# Altium project ePBR25_ACU_Power.PrjPCB (part 1 of 2)
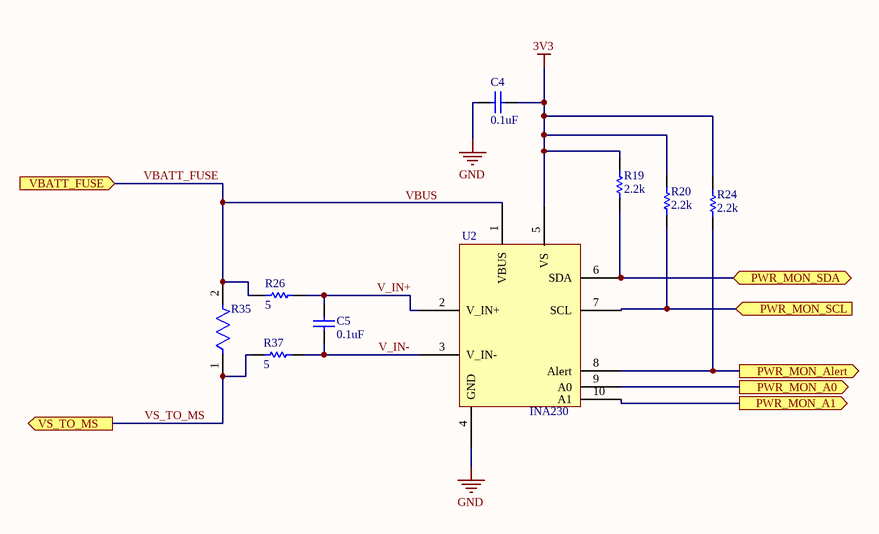
[diagram p0: 2  - Power Switch.SchDoc]
8 sheets, 154 parts. Net scope: hierarchical (ports join the sheet entries above them; power ports are global).
Board files: ePBR24_ACU_Power_rev0.PcbDoc, ePBR20_ACU_Power_rev0.PcbDoc, ePBR24_ACU_Power_rev0.PcbDoc, ePBR25_ACU_Power_rev0.PcbDoc, ePBR20_ACU_Power_rev0.PcbDoc
Sheets:
  2  - Power Switch.SchDoc
  1  - Connectors.SchDoc
    Designator = 2  - Battery Sensing and Control.SchDoc
    Designator = 3  - Fuses.SchDoc
    Designator = 6  - Load Drivers.SchDoc
    Designator = 8  - Voltage Conversions Delays.SchDoc
    Designator = 9  - UV OV Protection.SchDoc
    Designator = 10  - Latching Delay.SchDoc

## Sheet 2  - Power Switch.SchDoc
size A4

### Parts
(Parts that share a designator on the sheet are numbered #1, #2 ... from top to bottom, then left to right.)
C4#1  value 0.1uF  [0603R-generic]  (hidden comment: Cap)
C5#1  value 0.1uF  [0603R-generic]  (hidden comment: Cap)
R19#1  2.2k  [RESC0603(1608)_L]
R20#1  2.2k  [RESC0603(1608)_L]
R24#1  2.2k  [RESC0603(1608)_L]
R26#1  5  [RESC0603(1608)_L]
R35#1  WSLF25122L000FEA  [FP-WSLF25122L000FEA-MFG]  (value not drawn)
R37#1  5  [RESC0603(1608)_L]
U2#1  INA230  [SOP50P490X110-10N]

### Ports
PWR_MON_A0 (out), PWR_MON_A1 (out), PWR_MON_Alert (out), PWR_MON_SCL (in), PWR_MON_SDA (bidir), VBATT_FUSE (in), VS_TO_MS (out)

### Nets
3V3: C4#1.1 R19#1.2 R20#1.2 R24#1.2 U2#1.5(VS)
GND: C4#1.2 U2#1.4(GND)
PWR_MON_A0: U2#1.9(A0) ; port PWR_MON_A0
PWR_MON_A1: U2#1.10(A1) ; port PWR_MON_A1
PWR_MON_Alert: R24#1.1 U2#1.8(Alert) ; port PWR_MON_Alert
PWR_MON_SCL: R20#1.1 U2#1.7(SCL) ; port PWR_MON_SCL
PWR_MON_SDA: R19#1.1 U2#1.6(SDA) ; port PWR_MON_SDA
V_IN+: C5#1.2 R26#1.1 U2#1.2(V_IN+)
V_IN-: C5#1.1 R37#1.1 U2#1.3(V_IN-)
VBATT_FUSE: R26#1.2 R35#1.2 U2#1.1(VBUS) ; port VBATT_FUSE
VS_TO_MS: R35#1.1 R37#1.2 ; port VS_TO_MS

### Notes on the sheet
- Labels drawn without touching a wire or pin: VBUS

### Library data of the parts
C4#1 C5#1 = Cap: Capacitor; Manufacturer: Yageo; Manufacturer Part Number: CC1210ZKY5V8BB106; Capacitance: 10µF; Tolerance: -20%, +80%; Voltage - Rated: 25V; Temperature Coefficient: Y5V (F); Supplier 1: Digi-Key; Supplier Part Number 1: 311-2063-1-ND; RoHS: RoHS Compliant; Category: Capacitors; Stock 1: 1156; Pricing 1: 1=0.47, 10=0.323, 25=0.258, 50=0.2154, 100=0.1829, 250=0.14528, 500=0.12912, 1000=0.11298 (CAD); Packaging: Cut Tape (CT); Part Status: Active; Operating Temperature: -30°C ~ 85°C; Features: -; Ratings: -; Applications: General Purpose; Failure Rate: -; Mounting Type: Surface Mount, MLCC; Package / Case: 1210 (3225 Metric); Size / Dimension: 0.126" L x 0.098" W (3.20mm x 2.50mm); Height - Seated (Max): -; Thickness (Max): 0.083" (2.10mm); Lead Spacing: -; Lead Style: -; ComponentLink1URL: http://www.yageo.com/documents/recent/UPY-GPHC_Y5V_6.3V-to-50V_7.pdf; ComponentLink1Description: http://www.yageo.com/documents/recent/UPY-GPHC_Y5V_6.3V-to-50V_7.pdf; Supplier 2: Digi-Key; Supplier Part Number 2: 1276-1869-1-ND
R19#1 R20#1 R24#1 R26#1 R37#1 = CMP-1591-00001-1: 0603 (1608 Metric) Chip Resistor; Case-Metric: 1608; Case-EIA: 0603; PackageReference: RESC0603(1608); Supplier 1: Digi-Key; Supplier Part Number 1: P430BZCT-ND
R35#1 = CMP-02407-012168-1: RES 0.002 OHM 1% 5W 2512; Resistance: 2mR; Temperature Coefficient: 70ppm/°C; RoHS Compliant: Yes; Case/Package: 2512; Length: 0.25inch; Height: 0.024inch; Max Power Dissipation: 5W; Lead Free: Lead Free; Features: Moisture Resistant; Min Operating Temperature: -65°C; Max Operating Temperature: 170°C; Case Code (Metric): 6432; Tolerance: 1%; Width: 0.125inch; Case Code (Imperial): 2512; Packaging: Tape and Reel; Resistor Type: Metal Element; Number of Terminations: 2

## Sheet 1  - Connectors.SchDoc
size 471 x 281 mm
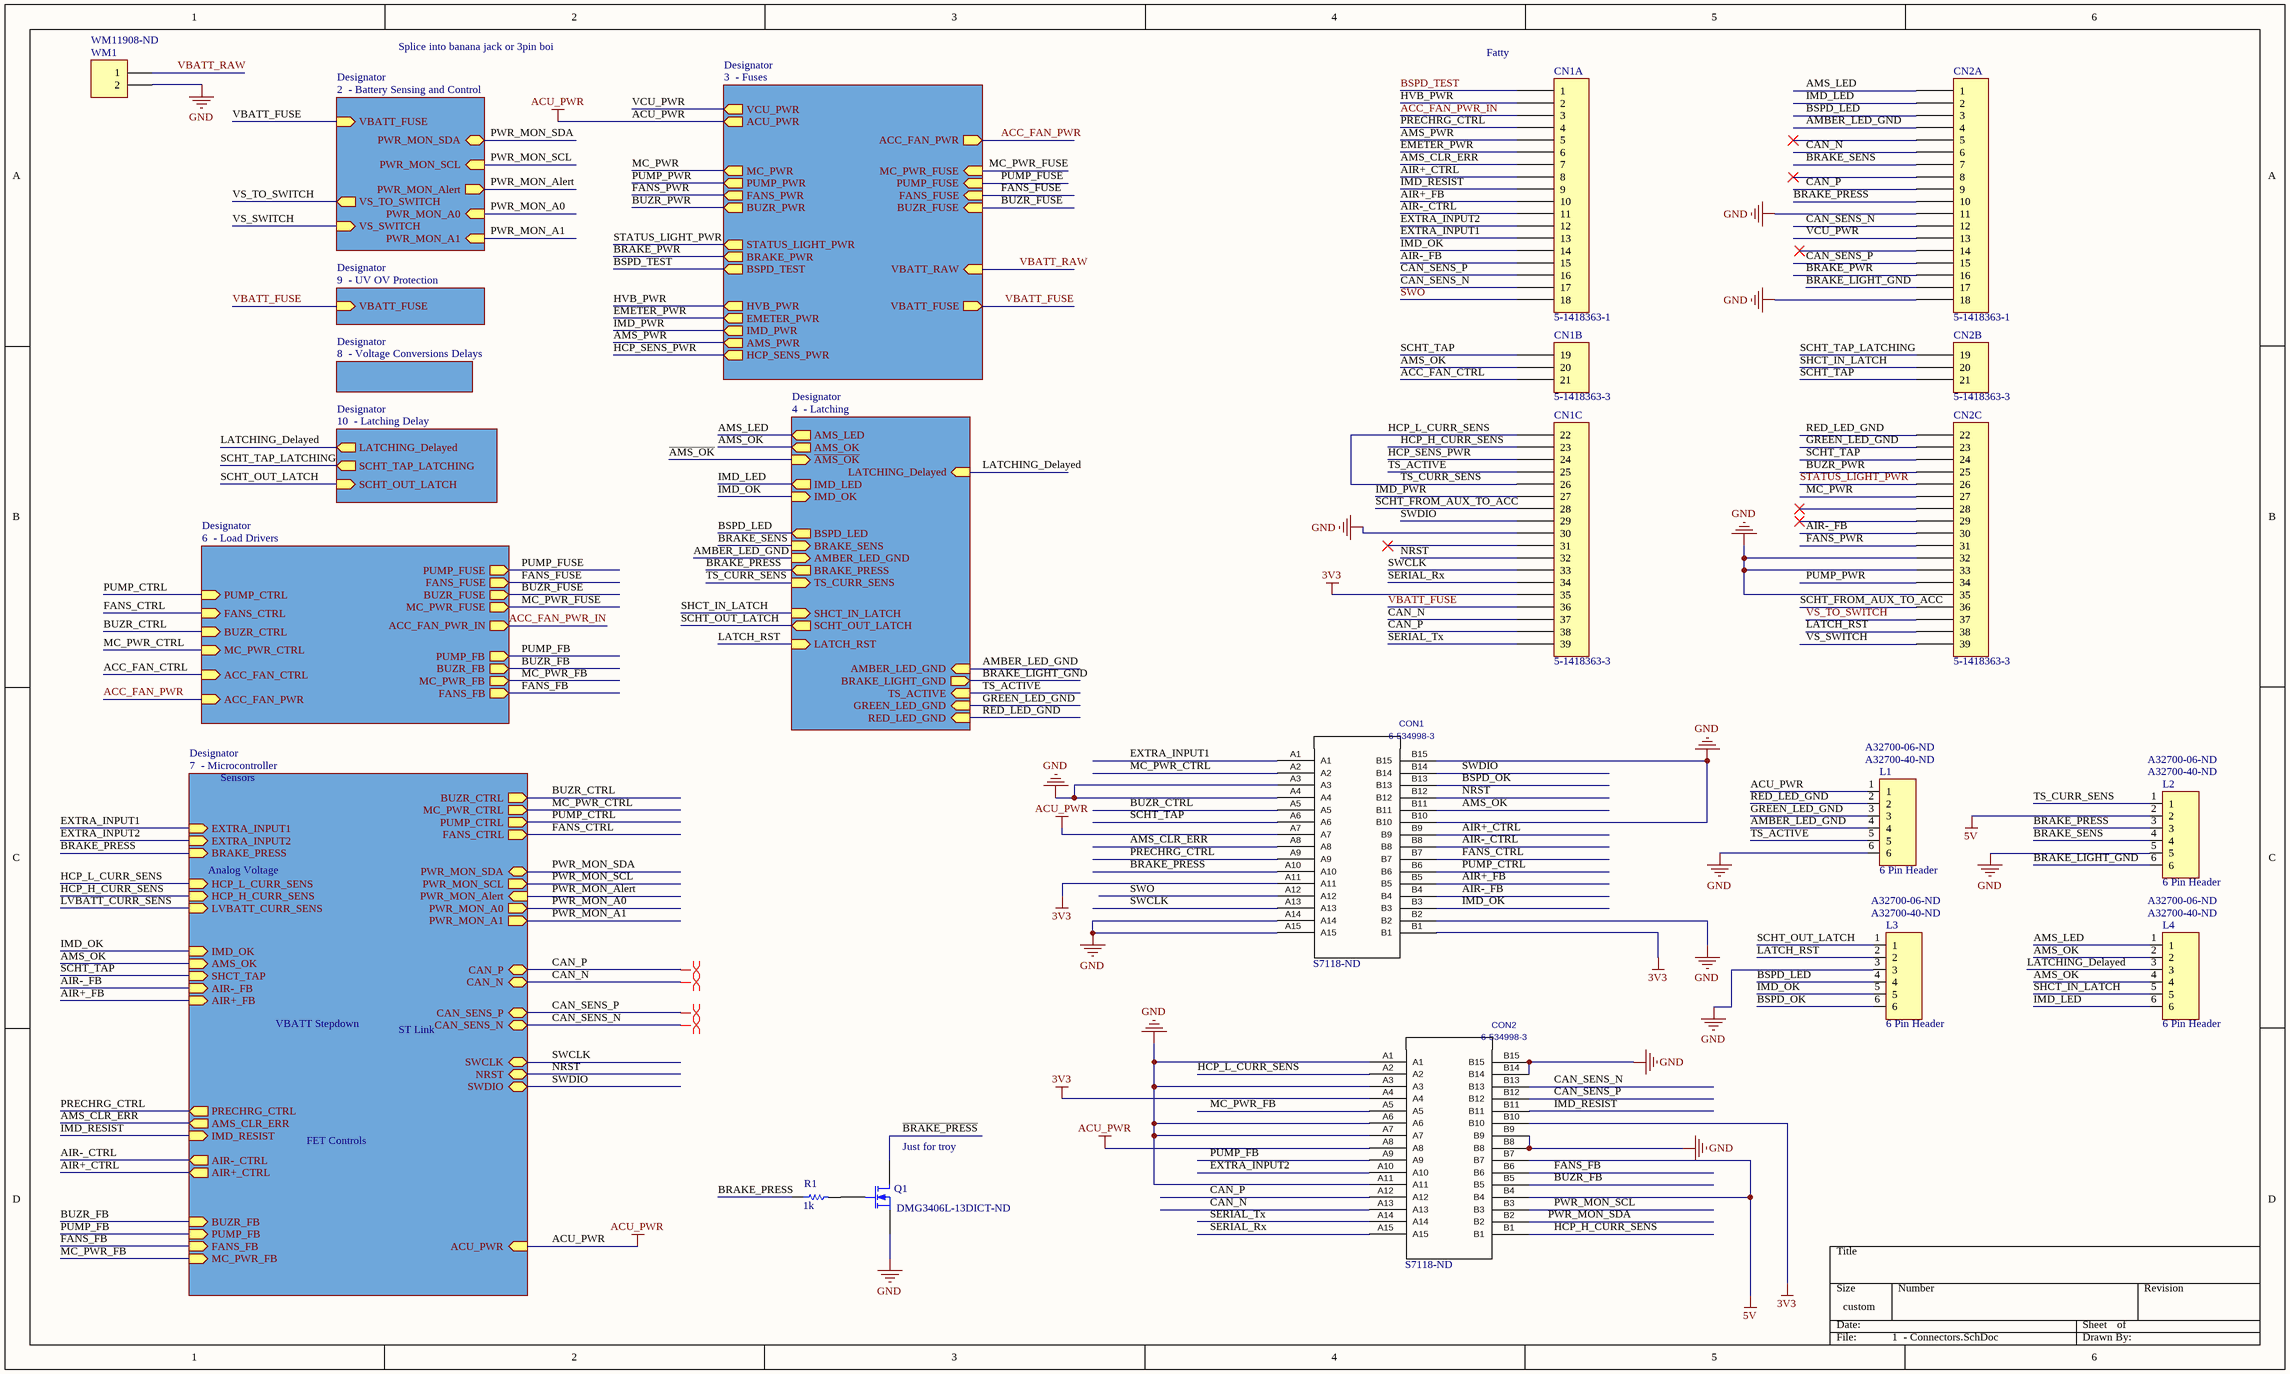
[diagram p1: 1  - Connectors.SchDoc]

### Parts
CN1  5-1418363-1  [LeavySeal 39 pin Ver]  (parts A,B,C of 3)
CN2  5-1418363-1  [LeavySeal 39 pin Ver]  (parts A,B,C of 3)
CON1  6-534998-3  Supplier Part Number 1: S7118-ND  [*TE_6-146257-5]
CON2  6-534998-3  Supplier Part Number 1: S7118-ND  [*TE_6-146257-5]
L1  6 Pin Header  Supplier Part Number 1: A32700-40-ND  Supplier Part Number 2: A32700-06-ND  [5-146285-6]
L2  6 Pin Header  Supplier Part Number 1: A32700-40-ND  Supplier Part Number 2: A32700-06-ND  [5-146285-6]
L3  6 Pin Header  Supplier Part Number 1: A32700-40-ND  Supplier Part Number 2: A32700-06-ND  [5-146285-6]
L4  6 Pin Header  Supplier Part Number 1: A32700-40-ND  Supplier Part Number 2: A32700-06-ND  [5-146285-6]
Q1  Supplier Part Number 1: DMG3406L-13DICT-ND  [SOT-23_N]
R1  1k  [RESC0603(1608)_L]
WM1  Supplier Part Number 1: WM11908-ND  [WM9796-ND]  (hidden comment: WM9796-ND)

### Sub-sheets
Designator = 2  - Battery Sensing and Control: VBATT_FUSE (in), VS_TO_SWITCH (out), PWR_MON_SDA (bidir), PWR_MON_SCL (in), PWR_MON_Alert (out), PWR_MON_A0 (in), PWR_MON_A1 (in), VS_SWITCH (in)
Designator = 3  - Fuses: VCU_PWR (out), MC_PWR (out), PUMP_PWR (out), FANS_PWR (out), BUZR_PWR (out), STATUS_LIGHT_PWR (out), BRAKE_PWR (out), ACU_PWR (out), BUZR_FUSE (in), FANS_FUSE (in), PUMP_FUSE (in), MC_PWR_FUSE (in), HVB_PWR (out), IMD_PWR (out), AMS_PWR (out), EMETER_PWR (out), HCP_SENS_PWR (out), BSPD_TEST (out), VBATT_RAW (in), VBATT_FUSE (out), ACC_FAN_PWR (out)
Designator = 4  - Latching (file not in this document): AMS_LED (out), SHCT_IN_LATCH (in), IMD_LED (out), BSPD_LED (out), SCHT_OUT_LATCH (out), AMS_OK (out), IMD_OK (in), LATCH_RST (in), TS_ACTIVE (in), GREEN_LED_GND (in), RED_LED_GND (in), ~{AMS_OK} (in), LATCHING_Delayed (in), BRAKE_PRESS (out), TS_CURR_SENS (in), BRAKE_LIGHT_GND (out), BRAKE_SENS (in), AMBER_LED_GND (in), AMBER_LED_GND (in)
Designator = 6  - Load Drivers: PUMP_CTRL (in), FANS_CTRL (in), BUZR_CTRL (in), MC_PWR_CTRL (in), PUMP_FUSE (out), FANS_FUSE (out), BUZR_FUSE (out), MC_PWR_FUSE (out), MC_PWR_FB (out), PUMP_FB (out), BUZR_FB (out), FANS_FB (out), ACC_FAN_CTRL (in), ACC_FAN_PWR (in), ACC_FAN_PWR_IN (out)
Designator = 7  - Microcontroller (file not in this document): EXTRA_INPUT1 (in), EXTRA_INPUT2 (in), LVBATT_CURR_SENS (in), PRECHRG_CTRL (out), HCP_L_CURR_SENS (in), HCP_H_CURR_SENS (in), BUZR_CTRL (out), MC_PWR_CTRL (out), PUMP_CTRL (out), FANS_CTRL (out), CAN_P (bidir), CAN_N (bidir), SWCLK (bidir), NRST (bidir), SWDIO (bidir), IMD_RESIST (in), AMS_CLR_ERR (out), AIR-_CTRL (out), AIR+_CTRL (out), PUMP_FB (in), FANS_FB (in), MC_PWR_FB (in), BUZR_FB (in), CAN_SENS_P (bidir), CAN_SENS_N (bidir), ACU_PWR (in), BRAKE_PRESS (in), IMD_OK (in), AMS_OK (in), SHCT_TAP (in), AIR-_FB (in), AIR+_FB (in), PWR_MON_SDA (bidir), PWR_MON_SCL (out), PWR_MON_Alert (in), PWR_MON_A0 (out), PWR_MON_A1 (out)
Designator = 8  - Voltage Conversions Delays: no entries
Designator = 9  - UV OV Protection: VBATT_FUSE (in)
Designator = 10  - Latching Delay: LATCHING_Delayed (out), SCHT_TAP_LATCHING (out), SCHT_OUT_LATCH (in)

### Nets
3V3: CN1.35 CON1.A11 CON1.B1 CON2.A4 CON2.B10
5V: CON2.B4 CON2.B7 L2.2
ACU_PWR: CON1.A7 CON2.A8 L1.1 ; sheet Designator/ACU_PWR, sheet Designator/ACU_PWR
GND: CN1.30 CN2.11 CN2.18 CN2.32 CN2.33 CN2.35 CON1.A3 CON1.A4 CON1.A14 CON1.A15 CON1.B2 CON1.B10 CON1.B15 CON2.A1 CON2.A3 CON2.A6 CON2.A7 CON2.A11 CON2.B8 CON2.B9 CON2.B14 CON2.B15 L1.6 L2.5 L3.3 Q1.2(S) WM1.2
~{AMS_OK}: CN1.20 L4.2 ; sheet Designator/~{AMS_OK}
ACC_FAN_CTRL: CN1.21 ; sheet Designator/ACC_FAN_CTRL
ACC_FAN_PWR: sheet Designator/ACC_FAN_PWR, sheet Designator/ACC_FAN_PWR
ACC_FAN_PWR_IN: CN1.3 ; sheet Designator/ACC_FAN_PWR_IN
AIR+_CTRL: CN1.8 CON1.B9 ; sheet Designator/AIR+_CTRL
AIR+_FB: CN1.10 CON1.B5 ; sheet Designator/AIR+_FB
AIR-_CTRL: CN1.11 CON1.B8 ; sheet Designator/AIR-_CTRL
AIR-_FB: CN1.15 CN2.30 CON1.B4 ; sheet Designator/AIR-_FB
AMBER_LED_GND: CN2.4 L1.4 ; sheet Designator/AMBER_LED_GND, sheet Designator/AMBER_LED_GND
AMS_CLR_ERR: CN1.7 CON1.A8 ; sheet Designator/AMS_CLR_ERR
AMS_LED: CN2.1 L4.1 ; sheet Designator/AMS_LED
AMS_OK: CON1.B11 L4.4 ; sheet Designator/AMS_OK, sheet Designator/AMS_OK
AMS_PWR: CN1.5 ; sheet Designator/AMS_PWR
~{BRAKE_PRESS}: CN2.10 Q1.3(D)
BRAKE_LIGHT_GND: CN2.17 L2.6 ; sheet Designator/BRAKE_LIGHT_GND
BRAKE_PRESS: CON1.A10 L2.3 R1.1 ; sheet Designator/BRAKE_PRESS, sheet Designator/BRAKE_PRESS
BRAKE_PWR: CN2.16 ; sheet Designator/BRAKE_PWR
BRAKE_SENS: CN2.7 L2.4 ; sheet Designator/BRAKE_SENS
BSPD_LED: CN2.3 L3.4 ; sheet Designator/BSPD_LED
BSPD_OK: CON1.B13 L3.6
BSPD_TEST: CN1.1 ; sheet Designator/BSPD_TEST
BUZR_CTRL: CON1.A5 ; sheet Designator/BUZR_CTRL, sheet Designator/BUZR_CTRL
BUZR_FB: CON2.B5 ; sheet Designator/BUZR_FB, sheet Designator/BUZR_FB
BUZR_FUSE: sheet Designator/BUZR_FUSE, sheet Designator/BUZR_FUSE
BUZR_PWR: CN2.25 ; sheet Designator/BUZR_PWR
CAN_N: CN1.37 CN2.6 CON2.A13 ; sheet Designator/CAN_N
CAN_P: CN1.38 CN2.9 CON2.A12 ; sheet Designator/CAN_P
CAN_SENS_N: CN1.17 CN2.12 CON2.B13 ; sheet Designator/CAN_SENS_N
CAN_SENS_P: CN1.16 CN2.15 CON2.B12 ; sheet Designator/CAN_SENS_P
EMETER_PWR: CN1.6 ; sheet Designator/EMETER_PWR
EXTRA_INPUT1: CN1.13 CON1.A1 ; sheet Designator/EXTRA_INPUT1
EXTRA_INPUT2: CN1.12 CON2.A10 ; sheet Designator/EXTRA_INPUT2
FANS_CTRL: CON1.B7 ; sheet Designator/FANS_CTRL, sheet Designator/FANS_CTRL
FANS_FB: CON2.B6 ; sheet Designator/FANS_FB, sheet Designator/FANS_FB
FANS_FUSE: sheet Designator/FANS_FUSE, sheet Designator/FANS_FUSE
FANS_PWR: CN2.31 ; sheet Designator/FANS_PWR
GREEN_LED_GND: CN2.23 L1.3 ; sheet Designator/GREEN_LED_GND
HCP_H_CURR_SENS: CN1.23 CON2.B1 ; sheet Designator/HCP_H_CURR_SENS
HCP_L_CURR_SENS: CN1.22 CN1.26 CON2.A2 L2.1 ; sheet Designator/TS_CURR_SENS, sheet Designator/HCP_L_CURR_SENS  [also labelled TS_CURR_SENS]
HCP_SENS_PWR: CN1.24 ; sheet Designator/HCP_SENS_PWR
HVB_PWR: CN1.2 ; sheet Designator/HVB_PWR
IMD_LED: CN2.2 L4.6 ; sheet Designator/IMD_LED
IMD_OK: CN1.14 CON1.B3 L3.5 ; sheet Designator/IMD_OK, sheet Designator/IMD_OK
IMD_PWR: CN1.27 ; sheet Designator/IMD_PWR
IMD_RESIST: CN1.9 CON2.B11 ; sheet Designator/IMD_RESIST
LATCH_RST: CN2.38 L3.2 ; sheet Designator/LATCH_RST
LATCHING_Delayed: L4.3 ; sheet Designator/LATCHING_Delayed, sheet Designator/LATCHING_Delayed
LVBATT_CURR_SENS: sheet Designator/LVBATT_CURR_SENS
MC_PWR: CN2.27 ; sheet Designator/MC_PWR
MC_PWR_CTRL: CON1.A2 ; sheet Designator/MC_PWR_CTRL, sheet Designator/MC_PWR_CTRL
MC_PWR_FB: CON2.A5 ; sheet Designator/MC_PWR_FB, sheet Designator/MC_PWR_FB
MC_PWR_FUSE: sheet Designator/MC_PWR_FUSE, sheet Designator/MC_PWR_FUSE
NRST: CN1.32 CON1.B12 ; sheet Designator/NRST
PRECHRG_CTRL: CN1.4 CON1.A9 ; sheet Designator/PRECHRG_CTRL
PUMP_CTRL: CON1.B6 ; sheet Designator/PUMP_CTRL, sheet Designator/PUMP_CTRL
PUMP_FB: CON2.A9 ; sheet Designator/PUMP_FB, sheet Designator/PUMP_FB
PUMP_FUSE: sheet Designator/PUMP_FUSE, sheet Designator/PUMP_FUSE
PUMP_PWR: CN2.34 ; sheet Designator/PUMP_PWR
PWR_MON_A0: sheet Designator/PWR_MON_A0, sheet Designator/PWR_MON_A0
PWR_MON_A1: sheet Designator/PWR_MON_A1, sheet Designator/PWR_MON_A1
PWR_MON_Alert: sheet Designator/PWR_MON_Alert, sheet Designator/PWR_MON_Alert
PWR_MON_SCL: CON2.B3 ; sheet Designator/PWR_MON_SCL, sheet Designator/PWR_MON_SCL
PWR_MON_SDA: CON2.B2 ; sheet Designator/PWR_MON_SDA, sheet Designator/PWR_MON_SDA
RED_LED_GND: CN2.22 L1.2 ; sheet Designator/RED_LED_GND
SCHT_FROM_AUX_TO_ACC: CN1.28 CN2.36
SCHT_OUT_LATCH: L3.1 ; sheet Designator/SCHT_OUT_LATCH, sheet Designator/SCHT_OUT_LATCH
SCHT_TAP: CN1.19 CN2.21 CN2.24 CON1.A6 ; sheet Designator/SHCT_TAP
SCHT_TAP_LATCHING: CN2.19 ; sheet Designator/SCHT_TAP_LATCHING
SERIAL_Rx: CN1.34 CON2.A15
SERIAL_Tx: CN1.39 CON2.A14
SHCT_IN_LATCH: CN2.20 L4.5 ; sheet Designator/SHCT_IN_LATCH
STATUS_LIGHT_PWR: CN2.26 ; sheet Designator/STATUS_LIGHT_PWR
SWCLK: CN1.33 CON1.A13 ; sheet Designator/SWCLK
SWDIO: CN1.29 CON1.B14 ; sheet Designator/SWDIO
SWO: CN1.18 CON1.A12
TS_ACTIVE: CN1.25 L1.5 ; sheet Designator/TS_ACTIVE
VBATT_FUSE: CN1.36 ; sheet Designator/VBATT_FUSE, sheet Designator/VBATT_FUSE, sheet Designator/VBATT_FUSE
VBATT_RAW: WM1.1 ; sheet Designator/VBATT_RAW
VCU_PWR: CN2.13 ; sheet Designator/VCU_PWR
VS_SWITCH: CN2.39 ; sheet Designator/VS_SWITCH
VS_TO_SWITCH: CN2.37 ; sheet Designator/VS_TO_SWITCH
NetQ1_1: Q1.1(G) R1.2

Not connected (* = marked no-connect by the designer): CN1 31*; CN2 5* 8* 14* 28* 29*

### Layout directives
differential pair: CAN_N, CAN_P, CAN_SENS_N, CAN_SENS_P

### Notes on the sheet
- Splice into banana jack or 3pin boi
- Fatty
- Sensors
- Analog Voltage
- VBATT Stepdown
- ST Link
- FET Controls
- (near Q1) Just for troy

### Library data of the parts
CN1 CN2 = 5-1418363-3: Levyseal Vertical 39 pin header
CON1 CON2 = 6-534998-3: C: Copyright (C) 2015 Accelerated Designs. All rights reserved; Vendor: TE Connectivity; Built_By: EMA_UL_Team; Value: 6-534998-3; Manufacturer_Part_Number: 6-534998-3; Supplier 1: Digi-Key
Q1 = MOSFET-N: N-Channel MOSFET; Manufacturer: Infineon Technologies; FET Type: MOSFET N-Channel, Metal Oxide; FET Feature: Logic Level Gate; Drain to Source Voltage (Vdss): 30V; Current - Continuous Drain (Id) @ 25°C: 50A (Tc); Rds On (Max) @ Id, Vgs: 7.5 mOhm @ 30A, 10V; Vgs(th) (Max) @ Id: 2.2V @ 250µA; Gate Charge (Qg) @ Vgs: 18nC @ 10V; Input Capacitance (Ciss) @ Vds: 1900pF @ 15V; Power - Max: 47W; Published: 8-Jun-2000; LatestRevisionDate: 17-Jul-2002; LatestRevisionNote: Re-released for DXP Platform.; PackageVersion: 1995/1996; PackageReference: E3; Publisher: Altium Limited; PackageDescription: TO, Flat Index; 3 In-Line, Axial Leads; Body Dia. 4.6mm; Lead Dia. 0.5 mm (max); RoHS: RoHS Compliant; Category: Discrete Semiconductor Products; Packaging: Cut Tape (CT); Mounting Type: Surface Mount; Package / Case: TO-252-3, DPak (2 Leads + Tab), SC-63; Supplier Device Package: PG-TO252-3; ComponentLink1URL: http://www.infineon.com/dgdl/Infineon-IPD075N03LG-DS-v02_01-en.pdf?folderId=5546d4694909da4801490a07012f053b&fileId=db3a30431936bc4b011951d824f83aeb; ComponentLink1Description: http://www.infineon.com/dgdl/Infineon-IPD075N03LG-DS-v02_01-en.pdf?folderId=5546d4694909da4801490a07012f053b&fileId=db3a30431936bc4b011951d824f83aeb; ComponentLink2URL: http://www.semicon.toshiba.co.jp/info/docget.jsp?type=datasheet&lang=en&pid=SSM3K329R; ComponentLink2Description: http://www.semicon.toshiba.co.jp/info/docget.jsp?type=datasheet&lang=en&pid=SSM3K329R; Supplier 1: Digi-Key
R1 = CMP-1591-00001-1: as R19#1 on sheet 2  - Power Switch; Value: 1k; PackageReference: RESC0603(1608); Supplier 1: Digi-Key; Supplier Part Number 1: P1.00KHCT-ND
WM1 = Header 2: Header, 2-Pin; LatestRevisionDate: 17-Jul-2002; LatestRevisionNote: Re-released for DXP Platform.; Publisher: Altium Limited; Supplier 1: Digi-Key
L1-L4 = 6 Pin Header: Supplier 1: Digi-Key; Supplier 2: Digi-Key

## Sheet 2  - Battery Sensing and Control.SchDoc
size A4
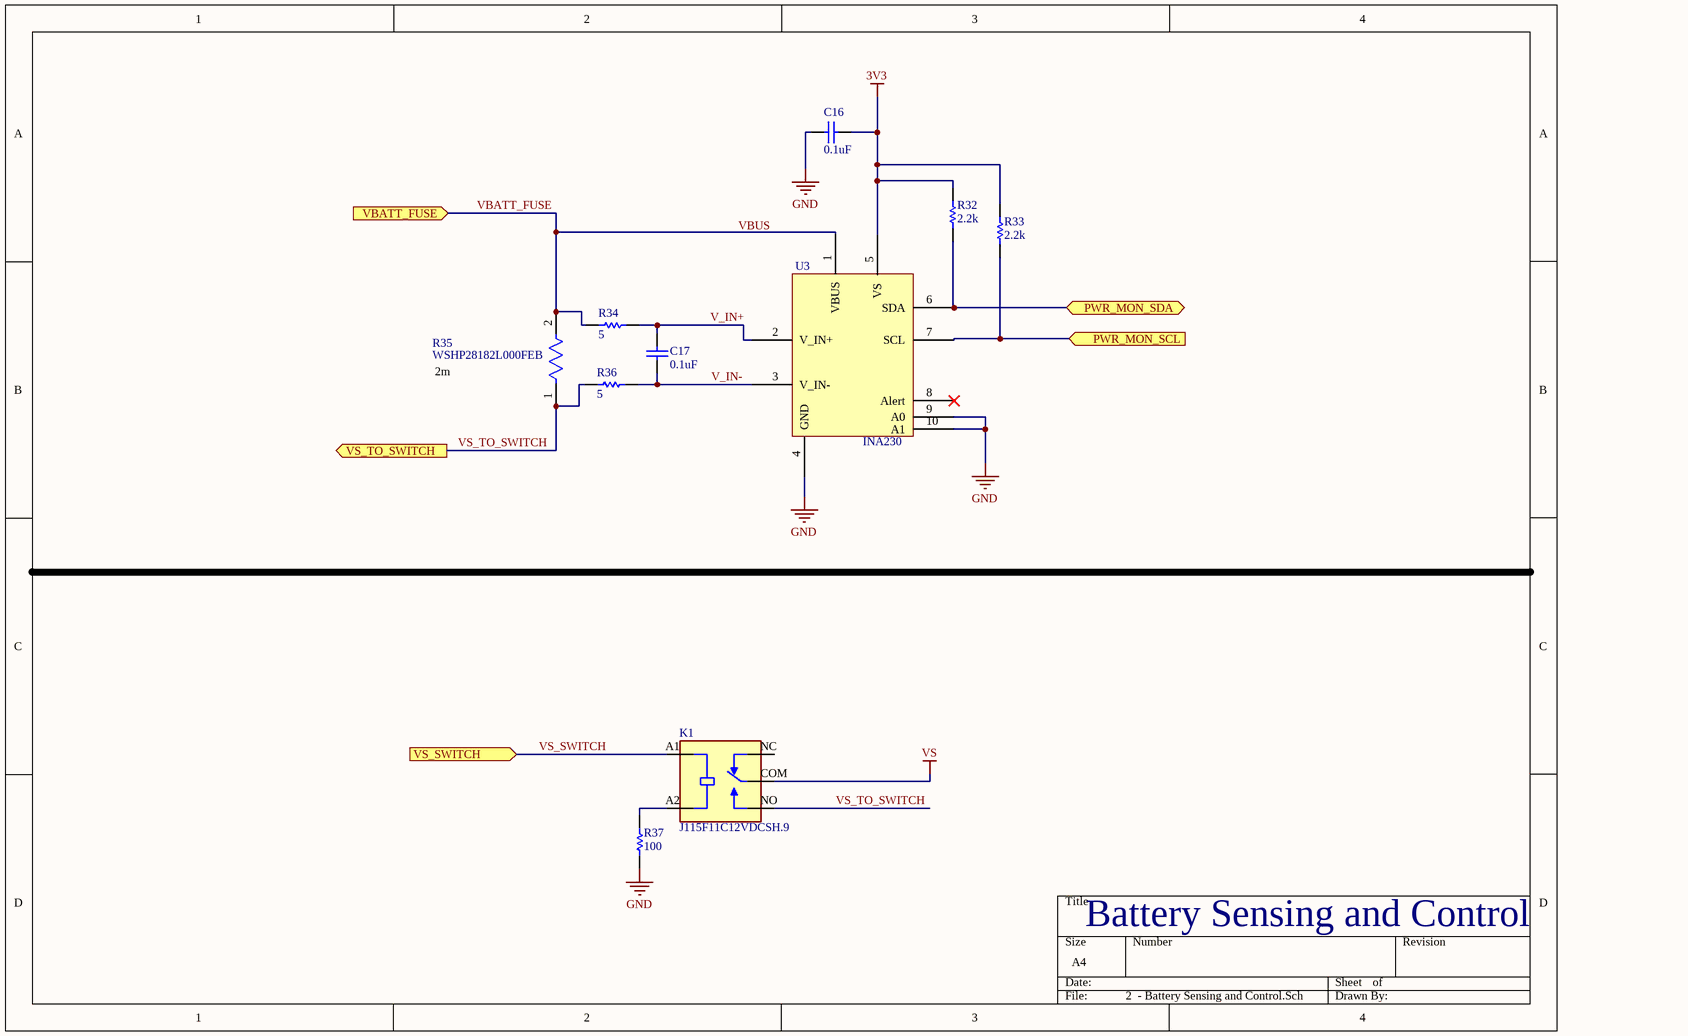
[diagram p2: 2  - Battery Sensing and Control.SchDoc]

### Parts
(Parts that share a designator on the sheet are numbered #1, #2 ... from top to bottom, then left to right.)
C16  value 0.1uF  [0603R-generic]  (hidden comment: Cap)
C17  value 0.1uF  [0603R-generic]  (hidden comment: Cap)
K1  J115F11C12VDCSH.9  [RELAY_J115F11C12VDCSH.9]
R32  2.2k  [RESC0603(1608)_L]
R33  2.2k  [RESC0603(1608)_L]
R34  5  [RESC0603(1608)_L]
R35#2  WSHP28182L000FEB  [FP-WSHP2818-MFG]
R36  5  [RESC0603(1608)_L]
R37#2  100  [RESC0603(1608)_L]
U3  INA230  [SOP50P490X110-10N]

### Ports
PWR_MON_SCL (in), PWR_MON_SDA (bidir), VBATT_FUSE (in), VS_SWITCH (in), VS_TO_SWITCH (out)

### Nets
3V3: C16.1 R32.2 R33.2 U3.5(VS)
GND: C16.2 R37#2.2 U3.4(GND) U3.9(A0) U3.10(A1)
VS: K1.COM
PWR_MON_SCL: R33.1 U3.7(SCL) ; port PWR_MON_SCL
PWR_MON_SDA: R32.1 U3.6(SDA) ; port PWR_MON_SDA
V_IN+: C17.2 R34.1 U3.2(V_IN+)
V_IN-: C17.1 R36.1 U3.3(V_IN-)
VBATT_FUSE: R34.2 R35#2.2 U3.1(VBUS) ; port VBATT_FUSE
VS_SWITCH: K1.A1(COIL1) ; port VS_SWITCH
VS_TO_SWITCH: K1.NO R35#2.1 R36.2 ; port VS_TO_SWITCH
NetK1_A2: K1.A2(COIL2) R37#2.1

Not connected (* = marked no-connect by the designer): K1 NC; U3 8(Alert)*

### Notes on the sheet
- 2m
- Battery Sensing and Control
- Labels drawn without touching a wire or pin: VBUS

### Library data of the parts
C16 C17 = Cap: as C4#1 on sheet 2  - Power Switch; Supplier 1: Digi-Key; Supplier Part Number 1: 311-2063-1-ND; RoHS: RoHS Compliant; Category: Capacitors; Stock 1: 1156; Pricing 1: 1=0.47, 10=0.323, 25=0.258, 50=0.2154, 100=0.1829, 250=0.14528, 500=0.12912, 1000=0.11298 (CAD); Packaging: Cut Tape (CT); Part Status: Active; Operating Temperature: -30°C ~ 85°C; Features: -; Ratings: -; Applications: General Purpose; Failure Rate: -; Mounting Type: Surface Mount, MLCC; Package / Case: 1210 (3225 Metric); Size / Dimension: 0.126" L x 0.098" W (3.20mm x 2.50mm); Height - Seated (Max): -; Thickness (Max): 0.083" (2.10mm); Lead Spacing: -; Lead Style: -; ComponentLink1URL: http://www.yageo.com/documents/recent/UPY-GPHC_Y5V_6.3V-to-50V_7.pdf; ComponentLink1Description: http://www.yageo.com/documents/recent/UPY-GPHC_Y5V_6.3V-to-50V_7.pdf; Supplier 2: Digi-Key; Supplier Part Number 2: 1276-1869-1-ND
K1 = J115F11C12VDCSH.9: General Purpose Relay SPDT (1 Form C) 12VDC Coil Through Hole; MF: CIT Relay and Switch; Availability: In Stock; SnapEDA_Link: https://www.snapeda.com/parts/J115F11C12VDCSH.9/CIT+Relay+%2526+Switch/view-part/?ref=snap; MP: J115F11C12VDCSH.9; Value: *; Price: None; Package: None; Purchase-URL: https://pricing.snapeda.com/search/part/J115F11C12VDCSH.9/?ref=eda; Check_prices: https://www.snapeda.com/parts/J115F11C12VDCSH.9/CIT+Relay+%2526+Switch/view-part/?ref=eda
R32-R34 R36 R37#2 = CMP-1591-00001-1: as R19#1 on sheet 2  - Power Switch; PackageReference: RESC0603(1608); Supplier 1: Digi-Key; Supplier Part Number 1: P430BZCT-ND
R35#2 = CMP-00030-78727543-1: WSHP28182L000FEB Res Metal Strip 2818 0.002 Ohm 1% 10W ±200ppm/C Pad SMD Automotive T/R; Temperature Coefficient: 200ppm/°C; Resistance: 2mΩ; Case/Package: 2818; Packaging: Cut Tape; NexarPartId: 78727543; Composition: Metal Element; Height: 3.43mm; Power Rating: 10W; Min Operating Temperature: -65°C; Schedule B: 8533210045, 8533210045; Max Operating Temperature: 170°C; Tolerance: 1%; RoHS: Non-Compliant

## Sheet 3  - Fuses.SchDoc
size 330 x 215 mm
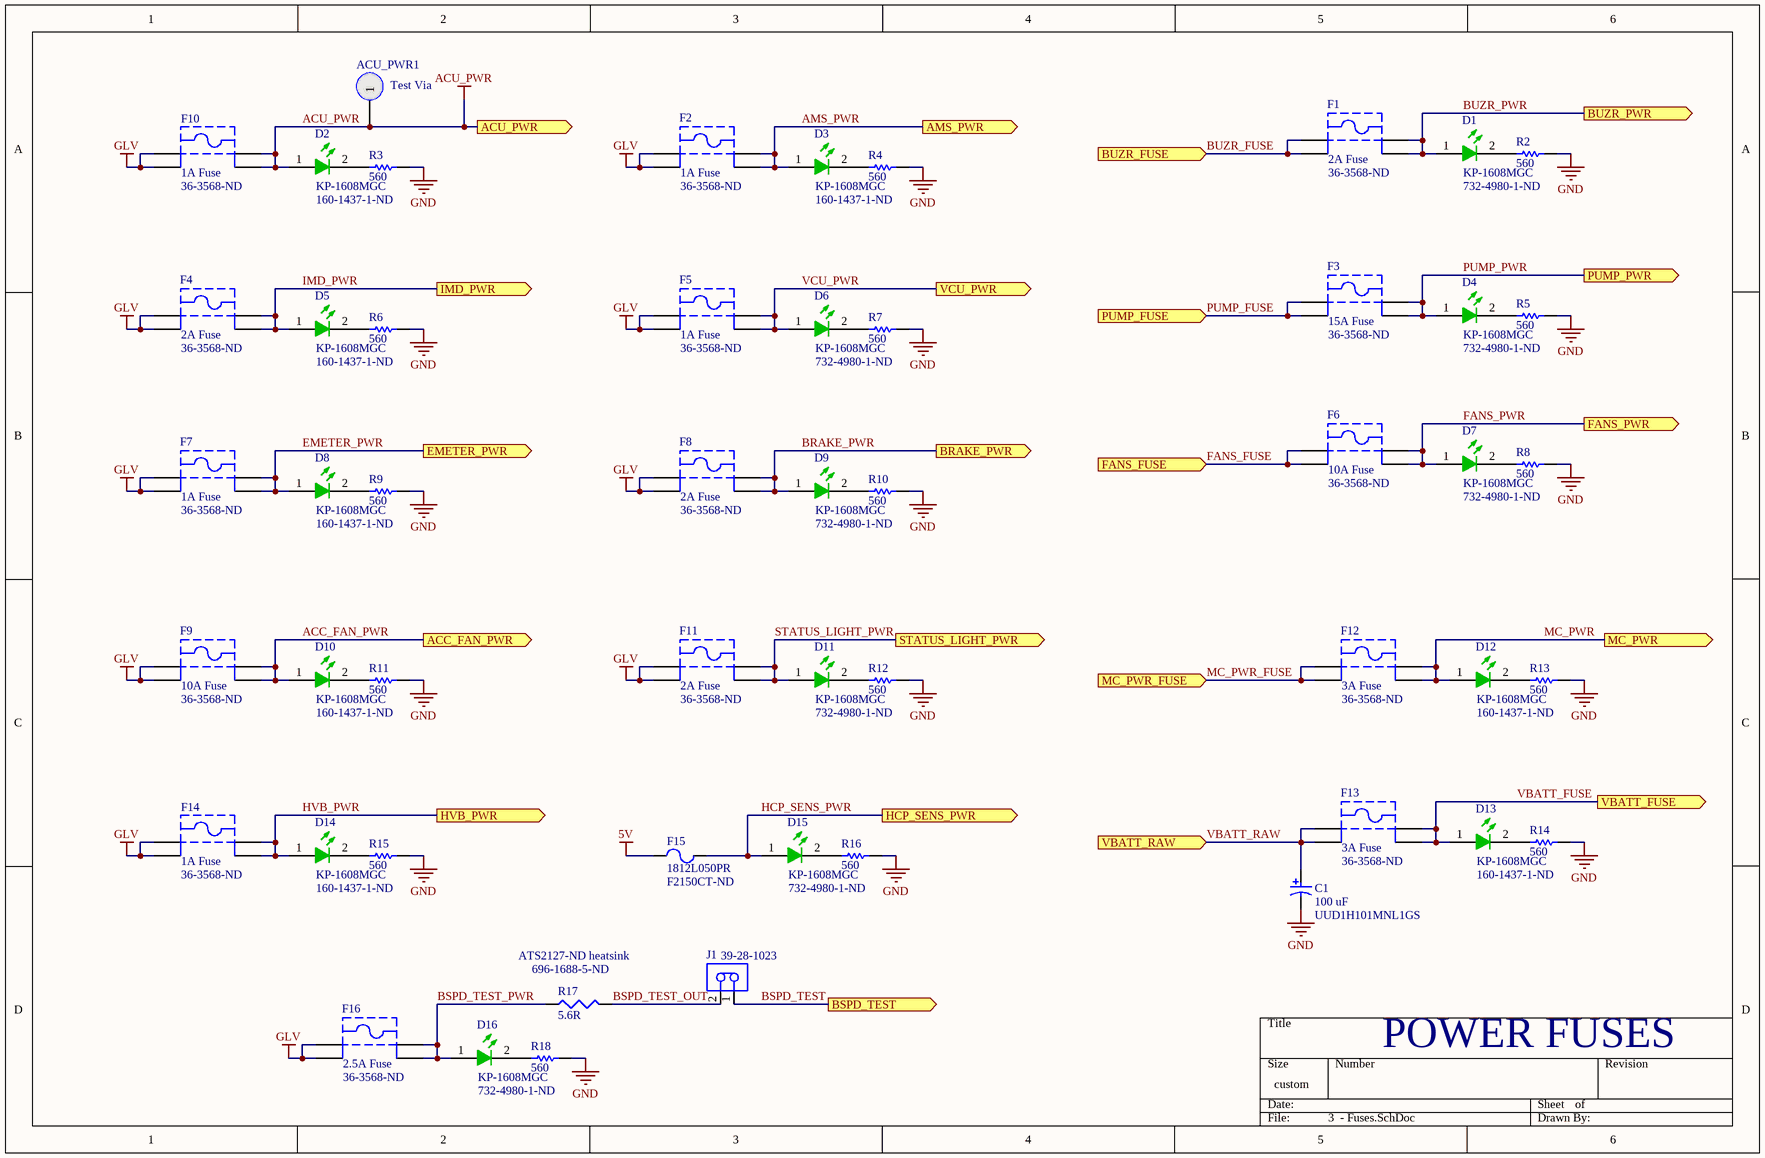
[diagram p3: 3  - Fuses.SchDoc]

### Parts
ACU_PWR1  Test Via  [Test Via]
C1  UUD1H101MNL1GS  Rated Capacitance: 100 uF  [NIC-CAPA2-8X10_V]
D1  KP-1608MGC  Supplier Part Number 1: 732-4980-1-ND  [KING-0603LED_GREEN_V]
D2  KP-1608MGC  Supplier Part Number 1: 160-1437-1-ND  [KING-0603LED_GREEN_V]
D3  KP-1608MGC  Supplier Part Number 1: 160-1437-1-ND  [KING-0603LED_GREEN_V]
D4  KP-1608MGC  Supplier Part Number 1: 732-4980-1-ND  [KING-0603LED_GREEN_V]
D5  KP-1608MGC  Supplier Part Number 1: 160-1437-1-ND  [KING-0603LED_GREEN_V]
D6  KP-1608MGC  Supplier Part Number 1: 732-4980-1-ND  [KING-0603LED_GREEN_V]
D7  KP-1608MGC  Supplier Part Number 1: 732-4980-1-ND  [KING-0603LED_GREEN_V]
D8  KP-1608MGC  Supplier Part Number 1: 160-1437-1-ND  [KING-0603LED_GREEN_V]
D9  KP-1608MGC  Supplier Part Number 1: 732-4980-1-ND  [KING-0603LED_GREEN_V]
D10  KP-1608MGC  Supplier Part Number 1: 160-1437-1-ND  [KING-0603LED_GREEN_V]
D11  KP-1608MGC  Supplier Part Number 1: 732-4980-1-ND  [KING-0603LED_GREEN_V]
D12  KP-1608MGC  Supplier Part Number 1: 160-1437-1-ND  [KING-0603LED_GREEN_V]
D13  KP-1608MGC  Supplier Part Number 1: 160-1437-1-ND  [KING-0603LED_GREEN_V]
D14  KP-1608MGC  Supplier Part Number 1: 160-1437-1-ND  [KING-0603LED_GREEN_V]
D15  KP-1608MGC  Supplier Part Number 1: 732-4980-1-ND  [KING-0603LED_GREEN_V]
D16  KP-1608MGC  Supplier Part Number 1: 732-4980-1-ND  [KING-0603LED_GREEN_V]
F1  36-3568-ND  [KSTN-3568_V]
F2  36-3568-ND  [KSTN-3568_V]
F3  36-3568-ND  [KSTN-3568_V]
F4  36-3568-ND  [KSTN-3568_V]
F5  36-3568-ND  [KSTN-3568_V]
F6  36-3568-ND  [KSTN-3568_V]
F7  36-3568-ND  [KSTN-3568_V]
F8  36-3568-ND  [KSTN-3568_V]
F9  36-3568-ND  [KSTN-3568_V]
F10  36-3568-ND  [KSTN-3568_V]
F11  36-3568-ND  [KSTN-3568_V]
F12  36-3568-ND  [KSTN-3568_V]
F13  36-3568-ND  [KSTN-3568_V]
F14  36-3568-ND  [KSTN-3568_V]
F15  1812L050PR  Supplier Part Number 1: F2150CT-ND  [LFUS-1812L050_V]
F16  36-3568-ND  [KSTN-3568_V]
J1  39-28-1023  [MOLX-39-28-1023-2_V]
R2  560  [RESC0603(1608)_L]
R3  560  [RESC0603(1608)_L]
R4  560  [RESC0603(1608)_L]
R5  560  [RESC0603(1608)_L]
R6  560  [RESC0603(1608)_L]
R7  560  [RESC0603(1608)_L]
R8  560  [RESC0603(1608)_L]
R9  560  [RESC0603(1608)_L]
R10  560  [RESC0603(1608)_L]
R11  560  [RESC0603(1608)_L]
R12  560  [RESC0603(1608)_L]
R13  560  [RESC0603(1608)_L]
R14  560  [RESC0603(1608)_L]
R15  560  [RESC0603(1608)_L]
R16  560  [RESC0603(1608)_L]
R17  5.6R  Supplier Part Number 1: 696-1688-5-ND  [TO220AC]
R18  560  [RESC0603(1608)_L]

### Ports
ACC_FAN_PWR (out), ACU_PWR (out), AMS_PWR (out), BRAKE_PWR (out), BSPD_TEST (out), BUZR_FUSE (in), BUZR_PWR (out), EMETER_PWR (out), FANS_FUSE (in), FANS_PWR (out), HCP_SENS_PWR (out), HVB_PWR (out), IMD_PWR (out), MC_PWR (out), MC_PWR_FUSE (in), PUMP_FUSE (in), PUMP_PWR (out), STATUS_LIGHT_PWR (out), VBATT_FUSE (out), VBATT_RAW (in), VCU_PWR (out)

### Nets
5V: F15.1
ACU_PWR: ACU_PWR1.1 D2.1(A) F10.3 F10.4 ; port ACU_PWR
GLV: F2.1 F2.2 F4.1 F4.2 F5.1 F5.2 F7.1 F7.2 F8.1 F8.2 F9.1 F9.2 F10.1 F10.2 F11.1 F11.2 F14.1 F14.2 F16.1 F16.2
GND: C1.2 R2.2 R3.2 R4.2 R5.2 R6.2 R7.2 R8.2 R9.2 R10.2 R11.2 R12.2 R13.2 R14.2 R15.2 R16.2 R18.2
ACC_FAN_PWR: D10.1(A) F9.3 F9.4 ; port ACC_FAN_PWR
AMS_PWR: D3.1(A) F2.3 F2.4 ; port AMS_PWR
BRAKE_PWR: D9.1(A) F8.3 F8.4 ; port BRAKE_PWR
BSPD_TEST: J1.1 ; port BSPD_TEST
BSPD_TEST_OUT: J1.2 R17.2
BSPD_TEST_PWR: D16.1(A) F16.3 F16.4 R17.1
BUZR_FUSE: F1.1 F1.2 ; port BUZR_FUSE
BUZR_PWR: D1.1(A) F1.3 F1.4 ; port BUZR_PWR
EMETER_PWR: D8.1(A) F7.3 F7.4 ; port EMETER_PWR
FANS_FUSE: F6.1 F6.2 ; port FANS_FUSE
FANS_PWR: D7.1(A) F6.3 F6.4 ; port FANS_PWR
HCP_SENS_PWR: D15.1(A) F15.2 ; port HCP_SENS_PWR
HVB_PWR: D14.1(A) F14.3 F14.4 ; port HVB_PWR
IMD_PWR: D5.1(A) F4.3 F4.4 ; port IMD_PWR
MC_PWR: D12.1(A) F12.3 F12.4 ; port MC_PWR
MC_PWR_FUSE: F12.1 F12.2 ; port MC_PWR_FUSE
PUMP_FUSE: F3.1 F3.2 ; port PUMP_FUSE
PUMP_PWR: D4.1(A) F3.3 F3.4 ; port PUMP_PWR
STATUS_LIGHT_PWR: D11.1(A) F11.3 F11.4 ; port STATUS_LIGHT_PWR
VBATT_FUSE: D13.1(A) F13.3 F13.4 ; port VBATT_FUSE
VBATT_RAW: C1.1 F13.1 F13.2 ; port VBATT_RAW
VCU_PWR: D6.1(A) F5.3 F5.4 ; port VCU_PWR
NetD1_2: D1.2(K) R2.1
NetD2_2: D2.2(K) R3.1
NetD3_2: D3.2(K) R4.1
NetD4_2: D4.2(K) R5.1
NetD5_2: D5.2(K) R6.1
NetD6_2: D6.2(K) R7.1
NetD7_2: D7.2(K) R8.1
NetD8_2: D8.2(K) R9.1
NetD9_2: D9.2(K) R10.1
NetD10_2: D10.2(K) R11.1
NetD11_2: D11.2(K) R12.1
NetD12_2: D12.2(K) R13.1
NetD13_2: D13.2(K) R14.1
NetD14_2: D14.2(K) R15.1
NetD15_2: D15.2(K) R16.1
NetD16_2: D16.2(K) R18.1

### Notes on the sheet
- (near F1) 2A Fuse
- (near F10) 1A Fuse
- (near F2) 1A Fuse
- (near F4) 2A Fuse
- (near F5) 1A Fuse
- (near F3) 15A Fuse
- (near F7) 1A Fuse
- (near F8) 2A Fuse
- (near F6) 10A Fuse
- (near F9) 10A Fuse
- (near F11) 2A Fuse
- (near F12) 3A Fuse
- (near F14) 1A Fuse
- (near F13) 3A Fuse
- (near R17) ATS2127-ND heatsink
- (near F16) 2.5A Fuse
- POWER FUSES

### Library data of the parts
C1 = CMP-0687-00073-1: Aluminum Electrolytic Capacitor, UD Series, Low Impedance, 100 uF, 50 V, + / - 20%, -55 to 105 degC, Chip Type, 8 x 10 mm D x L, Pb-Free, Reel; Manufacturer: Nichicon; Rated Ripple Current (at 100kHz): 300 mA; Tolerance Rated Capacitance: -20 to 20%; Packing: Dia382mm Reel; Impedance: 0.34 Ohm; Rated Voltage: 50 V; Endurance Time: 5000 h; Capacitance: 100µF; Voltage Rating: 50V; Lifetime @ Temp.: 5000 Hrs @ 105°C; Polarization: Polar; Ripple Current: 300mA; Surface Mount Land Size: 0.327" L x 0.327" W (8.30mm x 8.30mm); ComponentLink3Description: Package Specification; ComponentLink2Description: Datasheet; PackageReference: CAPAE-D8H10; RoHS: TRUE; Length: 10 mm; Mounting Technology: Surface Mount; PackageDescription: 2-Pin Surface Mount Device, Diameter 8 mm, Height 10 mm, Pitch 6.5 mm; DatasheetVersion: 08/2012; Diameter: 8 mm; ComponentLink3URL: http://products.nichicon.co.jp/en/pdf/XJA043/e-ud.pdf; ComponentLink1Description: Manufacturer URL; PartNumber: UUD1H101MNL1GS; ComponentLink2URL: http://products.nichicon.co.jp/en/pdf/XJA043/e-ud.pdf; ComponentLink1URL: http://www.nichicon.co.jp/; Supplier 1: Digi-Key; Supplier Part Number 1: 493-2306-1-ND; Manufacturer Part Number: UUD1H101MNL1GS; Category: Capacitors; Stock 1: 65948; Pricing 1: 1=0.92, 10=0.685, 25=0.5868, 50=0.5478, 100=0.4696, 250=0.43044 (CAD); Packaging: Cut Tape (CT); Part Status: Active; Tolerance: ±20%; ESR (Equivalent Series Resistance): -; Operating Temperature: -55°C ~ 105°C; Applications: General Purpose; Lead Spacing: -; Size / Dimension: 0.315" Dia (8.00mm); Height - Seated (Max): 0.394" (10.00mm); Mounting Type: Surface Mount; Package / Case: Radial, Can - SMD; ComponentLink4URL: http://nichicon-us.com/english/products/pdfs/e-uud.pdf; ComponentLink4Description: http://nichicon-us.com/english/products/pdfs/e-uud.pdf
D1-D16 = CMP-0404-00001-1: LED, SMT, 0603(1608), 1.1mm thickness, Green; Manufacturer: Kingbright; Reverse Voltage: 5 V; Power Dissipation: 75 mW; Forward Current: 30 mA; Packing Type: 2000 pcs / reel; Mounting Technology: Surface Mount; Storage Temperature: -40 to +85 degC; ComponentLink1URL: http://www.kingbright.com/; PackageDescription: 2-Pin SMT LED, 1.6 x 0.8 mm Pitch; PartNumber: KP-1608MGC; PackageReference: 0603LED_GREEN; ComponentLink1Description: Manufacturer URL; Supplier 1: Digi-Key
F1-F5 F7-F14 F16 = CMP-2000-05464-1: Fuse Holder, 20 A, 500 V, -50 to 145 degC, 4-Pin THD, RoHS; Manufacturer: Keystone; Package Reference: 3568; Datasheet Version: 04/2013; Datasheet URL: https://datasheet.ciiva.com/16294/m60-2p40-16294706.pdf; Manufacturer URL: http://www.keyelco.com/; Mounting Technology: ThroughHole; Package Description: 4-Pin Through Hole Device, Body 16 x 6.73 mm, Pitch 9.9 mm
F6 = CMP-2000-05464-1: Manufacturer: Keystone; Package Reference: 3568; Datasheet Version: 04/2013; Datasheet URL: https://datasheet.ciiva.com/16294/m60-2p40-16294706.pdf; Manufacturer URL: http://www.keyelco.com/; Mounting Technology: ThroughHole; Package Description: 4-Pin Through Hole Device, Body 16 x 6.73 mm, Pitch 9.9 mm
F15 = CMP-1700-00002-1: POLY-FUSE(R) Resettable PTC, 0.5 A, 0.15 to 1 Ohm Resistance, -40 to 85 degC, 1812 (4532 Metric), RoHS, Tape and Reel; Voltage Rating: 50 V; Power Rating: 100 mW; Resistance: 150 kohm; Tolerance: 1%; Case\Package: 0603; ComponentLink2URL: http://www.littelfuse.com/~/media/electronics/datasheets/resettable_ptcs/littelfuse_ptc_1812l_datasheet.pdf.pdf; Pins: 2; Mount: Surface Mount; Width: 0.8 mm; Length: 1.6 mm; Package Quantity: 1; Max Operating Temperature: 155 degC; Case Code (Imperial): 0603; ComponentLink1Description: Manufacturer URL; PackageReference: 1812; ComponentLink1URL: http://www.littelfuse.com/; RoHSCompliant: true; Voltage Rating (DC): 50 V; Packaging: Tape and Reel; PackageDescription: 2-Pin Surface Mount Device, Body 4.55 x 3.24 mm; Min Operating Temperature: -55 degC; DatasheetVersion: Feb-16; REACH SVHC: No SVHC; Case Code (Metric): 1608; ComponentLink2Description: Datasheet; Height: 0.45 mm; Supplier 1: Digi-Key
J1 = CMP-2000-05244-1: Female Header, Pitch 4.2 mm, 1 x 2 Position, Height 12.8 mm, Tail Length 3.5 mm, -40 to 105 degC, RoHS; Manufacturer: Molex; No. of Poles: 2; Working Voltage: 250V; No. of Rows: 1; Current Rating: 13A; Contact Termination: Solder; No. of Contacts: 4; Connector Body Material: –; Voltage Rating V AC: 600V; Mounting Orientation: Straight; Pitch Spacing: 4.2mm; Connector Mounting: PCB; Connector Type: RectangularPower; Manufacturer URL: http://www.molex.com/; Contact Plating: Tin; Gender: Header; Lead Spacing: 4.2mm; Colour: Clear; Series: Mini-FitJr; No. of Ways: 2; MSL: –; Connector Insert Type: Header; Flammability Rating: UL94V-2; Datasheet URL: https://datasheet.ciiva.com/11746/0900766b80460d9e-11746456.pdf; Termination Method: Solder; Mounting Type: PCBoard; Contact Material: Brass; Datasheet Version: Rev. F, 05/2004; SVHC: –; Connector Mounting Orientation: PCB; Contact Gender: –
R2-R16 R18 = CMP-1591-00001-1: as R19#1 on sheet 2  - Power Switch; PackageReference: RESC0603(1608); Supplier 1: Digi-Key; Supplier Part Number 1: P560BZCT-ND
R17 = Res3: Resistor; Published: 8-Jun-2000; LatestRevisionDate: 29-May-2009; LatestRevisionNote: IPC-7351 Footprint Added.; PackageReference: J1-0603; Publisher: Altium Limited; PackageDescription: Chip Resistor; Supplier 1: Digi-Key

## Sheet 6  - Load Drivers.SchDoc
size 304 x 198 mm
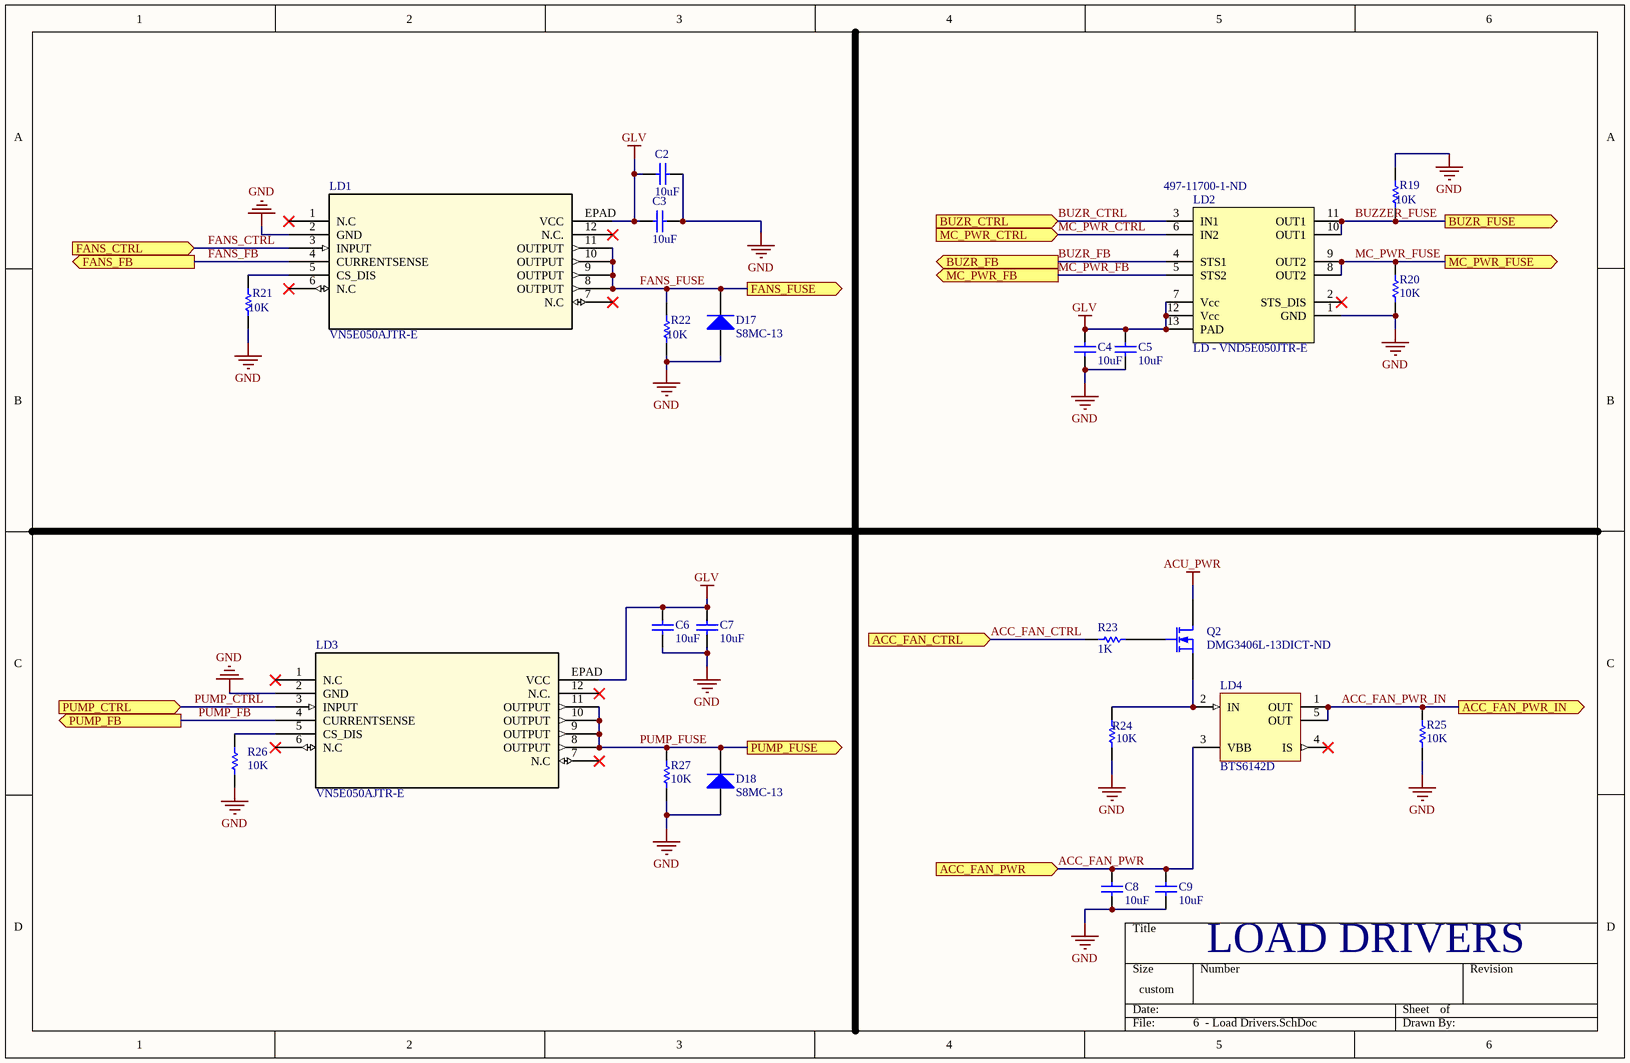
[diagram p4: 6  - Load Drivers.SchDoc]

### Parts
(Parts that share a designator on the sheet are numbered #1, #2 ... from top to bottom, then left to right.)
C2  value 10uF  [0603R-generic]  (hidden comment: Cap)
C3  value 10uF  [0603R-generic]  (hidden comment: Cap)
C4#2  value 10uF  [1608[0603]]  (hidden comment: Cap Semi)
C5#2  value 10uF  [1608[0603]]  (hidden comment: Cap Semi)
C6  value 10uF  [0603R-generic]  (hidden comment: Cap)
C7  value 10uF  [0603R-generic]  (hidden comment: Cap)
C8  value 10uF  [0603R-generic]  (hidden comment: Cap)
C9  value 10uF  [0603R-generic]  (hidden comment: Cap)
D17  S8MC-13  [S8MC-13]
D18  S8MC-13  [S8MC-13]
LD1  VN5E050AJTR-E  [SO_050AJ-E_STM]
LD2  LD - VND5E050JTR-E  Supplier Part Number 1: 497-11700-1-ND  [VND5E050JTR-E]
LD3  VN5E050AJTR-E  [SO_050AJ-E_STM]
LD4  BTS6142D  [INF-PG-TO252-5-11_M]
Q2  Supplier Part Number 1: DMG3406L-13DICT-ND  [SOT-23_N]
R19#2  10K  [RESC0603(1608)_L]
R20#2  10K  [RESC0603(1608)_L]
R21  10K  [RESC0603(1608)_L]
R22  10K  [RESC0603(1608)_L]
R23  1K  [RESC0603(1608)_L]
R24#2  10K  [RESC0603(1608)_L]
R25  10K  [RESC0603(1608)_L]
R26#2  10K  [RESC0603(1608)_L]
R27  10K  [RESC0603(1608)_L]

### Ports
ACC_FAN_CTRL (in), ACC_FAN_PWR (in), ACC_FAN_PWR_IN (out), BUZR_CTRL (in), BUZR_FB (out), BUZR_FUSE (out), FANS_CTRL (in), FANS_FB (out), FANS_FUSE (out), MC_PWR_CTRL (in), MC_PWR_FB (out), MC_PWR_FUSE (out), PUMP_CTRL (in), PUMP_FB (out), PUMP_FUSE (out)

### Nets
ACU_PWR: Q2.3(D)
GLV: C2.2 C3.2 C4#2.2 C5#2.2 C6.2 C7.2 LD1.EPAD(VCC) LD2.7(Vcc) LD2.12(Vcc) LD2.13(PAD) LD3.EPAD(VCC)
GND: C2.1 C3.1 C4#2.1 C5#2.1 C6.1 C7.1 C8.1 C9.1 D17.1(A) D18.1(A) LD1.2(GND) LD2.1(GND) LD3.2(GND) R19#2.2 R20#2.2 R21.1 R22.1 R24#2.2 R25.2 R26#2.1 R27.1
ACC_FAN_CTRL: R23.1 ; port ACC_FAN_CTRL
ACC_FAN_PWR: C8.2 C9.2 LD4.3(VBB) ; port ACC_FAN_PWR
ACC_FAN_PWR_IN: LD4.1(OUT) LD4.5(OUT) R25.1 ; port ACC_FAN_PWR_IN
BUZR_CTRL: LD2.3(IN1) ; port BUZR_CTRL
BUZR_FB: LD2.4(STS1) ; port BUZR_FB
BUZZER_FUSE: LD2.10(OUT1) LD2.11(OUT1) R19#2.1 ; port BUZR_FUSE  [project net BUZR_FUSE]
FANS_CTRL: LD1.3(INPUT) ; port FANS_CTRL
FANS_FB: LD1.4(CURRENTSENSE) ; port FANS_FB
FANS_FUSE: D17.2(K) LD1.8(OUTPUT) LD1.9(OUTPUT) LD1.10(OUTPUT) LD1.11(OUTPUT) R22.2 ; port FANS_FUSE
MC_PWR_CTRL: LD2.6(IN2) ; port MC_PWR_CTRL
MC_PWR_FB: LD2.5(STS2) ; port MC_PWR_FB
MC_PWR_FUSE: LD2.8(OUT2) LD2.9(OUT2) R20#2.1 ; port MC_PWR_FUSE
PUMP_CTRL: LD3.3(INPUT) ; port PUMP_CTRL
PUMP_FB: LD3.4(CURRENTSENSE) ; port PUMP_FB
PUMP_FUSE: D18.2(K) LD3.8(OUTPUT) LD3.9(OUTPUT) LD3.10(OUTPUT) LD3.11(OUTPUT) R27.2 ; port PUMP_FUSE
NetLD1_5: LD1.5(CS_DIS) R21.2
NetLD3_5: LD3.5(CS_DIS) R26#2.2
NetLD4_2: LD4.2(IN) Q2.2(S) R24#2.1
NetQ2_1: Q2.1(G) R23.2

Not connected (* = marked no-connect by the designer): LD1 1(N.C)* 6(N.C)* 7(N.C)* 12(N.C.)*; LD2 2(STS_DIS)*; LD3 1(N.C)* 6(N.C)* 7(N.C)* 12(N.C.)*; LD4 4(IS)*

### Notes on the sheet
- (near C9) LOAD DRIVERS

### Library data of the parts
C2 C3 C6-C9 = Cap: as C4#1 on sheet 2  - Power Switch; Supplier 1: Digi-Key; Supplier Part Number 1: 311-2063-1-ND; RoHS: RoHS Compliant; Category: Capacitors; Stock 1: 1156; Pricing 1: 1=0.47, 10=0.323, 25=0.258, 50=0.2154, 100=0.1829, 250=0.14528, 500=0.12912, 1000=0.11298 (CAD); Packaging: Cut Tape (CT); Part Status: Active; Operating Temperature: -30°C ~ 85°C; Features: -; Ratings: -; Applications: General Purpose; Failure Rate: -; Mounting Type: Surface Mount, MLCC; Package / Case: 1210 (3225 Metric); Size / Dimension: 0.126" L x 0.098" W (3.20mm x 2.50mm); Height - Seated (Max): -; Thickness (Max): 0.083" (2.10mm); Lead Spacing: -; Lead Style: -; ComponentLink1URL: http://www.yageo.com/documents/recent/UPY-GPHC_Y5V_6.3V-to-50V_7.pdf; ComponentLink1Description: http://www.yageo.com/documents/recent/UPY-GPHC_Y5V_6.3V-to-50V_7.pdf; Supplier 2: Digi-Key; Supplier Part Number 2: 1276-1869-1-ND
C4#2 C5#2 = Cap Semi: Capacitor (Semiconductor SIM Model); Published: 8-Jun-2000; LatestRevisionDate: 29-May-2009; LatestRevisionNote: IPC-7351 Footprint Added.; PackageReference: C1206; Publisher: Altium Limited; PackageDescription: Chip Capacitor; Supplier 1: Digi-Key; Supplier Part Number 1: 490-10991-1-ND
D17 D18 = Diode: Default Diode; Supplier 1: Digi-Key; Supplier Part Number 1: S8MCDICT-ND
LD2 = LOAD DRIVER - VND5E050JTR-E: Supplier 1: Digi-Key
LD4 = CMP-1095-00109-1: Smart High-Side Power Switch PROFET, 12 mOhm, 1 Channel, 8.5 A Load Current, -40 to 150 degC, PG-TO252-5-11, Reel, Green; Manufacturer: Infineon; toff (max): 600 us; Group: Automotive Qualified; Green: TRUE; Channels: 1; Recommended Operating Voltage Max.: 24 V; Load Current (typ): 8.5 A; RON(max) @ 150degreesC: 22 mOhm; RON @ 25degreesC: 12 mOhm; Ptot (max): 50 W; Recommended Operating Voltage Min.: 5.5 V; Halogen-free: TRUE; ComponentLink3Description: Package Specification; Mounting Technology: Surface Mount; PackageVersion: Nov-10; ComponentLink2URL: http://www.infineon.com/dgdl/BTS6142D_DS_v11.pdf?folderId=db3a304314dca389011537739e37155f&fileId=db3a3043183a9555011860661a7d367a&location=en.Products.Automotive_ICs.Smart_High-_and_Low-Side_Switches.PROFET__-_Smart_High_Side_Switches.DATASHEET.BTS6142D_D; PackageReference: PG-TO252-5-11; ComponentLink3URL: http://www.infineon.com/dgdl/TLE7276-Data+Sheet-+v1_11.pdf?folderId=db3a304412b407950112b408e8c90004&fileId=db3a304412b407950112b436c53f66c8&sId=db3a30433db6f09f013dc0e43c0428c1; ComponentLink2Description: Datasheet; ComponentLink1URL: http://www.infineon.com/; Packing: Reel; ComponentLink1Description: Manufacturer URL; DatasheetVersion: Rev. 1.1; ton (max): 600 us; PartNumber: BTS6142D; PackageDescription: 5-Pin Plastic (Green) Transistor Single Outline Package, 6.5 x 6.12 mm Body, 1.14 mm Pitch
Q2 = MOSFET-N: N-Channel MOSFET; Manufacturer: Infineon Technologies; Manufacturer Part Number: IPD075N03L G; FET Type: MOSFET N-Channel, Metal Oxide; FET Feature: Logic Level Gate; Drain to Source Voltage (Vdss): 30V; Current - Continuous Drain (Id) @ 25°C: 50A (Tc); Rds On (Max) @ Id, Vgs: 7.5 mOhm @ 30A, 10V; Vgs(th) (Max) @ Id: 2.2V @ 250µA; Gate Charge (Qg) @ Vgs: 18nC @ 10V; Input Capacitance (Ciss) @ Vds: 1900pF @ 15V; Power - Max: 47W; Published: 8-Jun-2000; LatestRevisionDate: 17-Jul-2002; LatestRevisionNote: Re-released for DXP Platform.; PackageVersion: 1995/1996; PackageReference: E3; Publisher: Altium Limited; PackageDescription: TO, Flat Index; 3 In-Line, Axial Leads; Body Dia. 4.6mm; Lead Dia. 0.5 mm (max); RoHS: RoHS Compliant; Category: Discrete Semiconductor Products; Packaging: Cut Tape (CT); Mounting Type: Surface Mount; Package / Case: TO-252-3, DPak (2 Leads + Tab), SC-63; Supplier Device Package: PG-TO252-3; ComponentLink1URL: http://www.infineon.com/dgdl/Infineon-IPD075N03LG-DS-v02_01-en.pdf?folderId=5546d4694909da4801490a07012f053b&fileId=db3a30431936bc4b011951d824f83aeb; ComponentLink1Description: http://www.infineon.com/dgdl/Infineon-IPD075N03LG-DS-v02_01-en.pdf?folderId=5546d4694909da4801490a07012f053b&fileId=db3a30431936bc4b011951d824f83aeb; ComponentLink2URL: http://www.semicon.toshiba.co.jp/info/docget.jsp?type=datasheet&lang=en&pid=SSM3K329R; ComponentLink2Description: http://www.semicon.toshiba.co.jp/info/docget.jsp?type=datasheet&lang=en&pid=SSM3K329R; Supplier 1: Digi-Key
R19#2 R20#2 R21-R23 R24#2 R25 R26#2 R27 = CMP-1591-00001-1: as R19#1 on sheet 2  - Power Switch; PackageReference: RESC0603(1608)
  R19#2 R20#2 R21 R22 R24#2 R25 R26#2 R27: Supplier 1: Digi-Key; Supplier Part Number 1: 311-10KGRCT-ND

## Sheet 8  - Voltage Conversions Delays.SchDoc
size A4
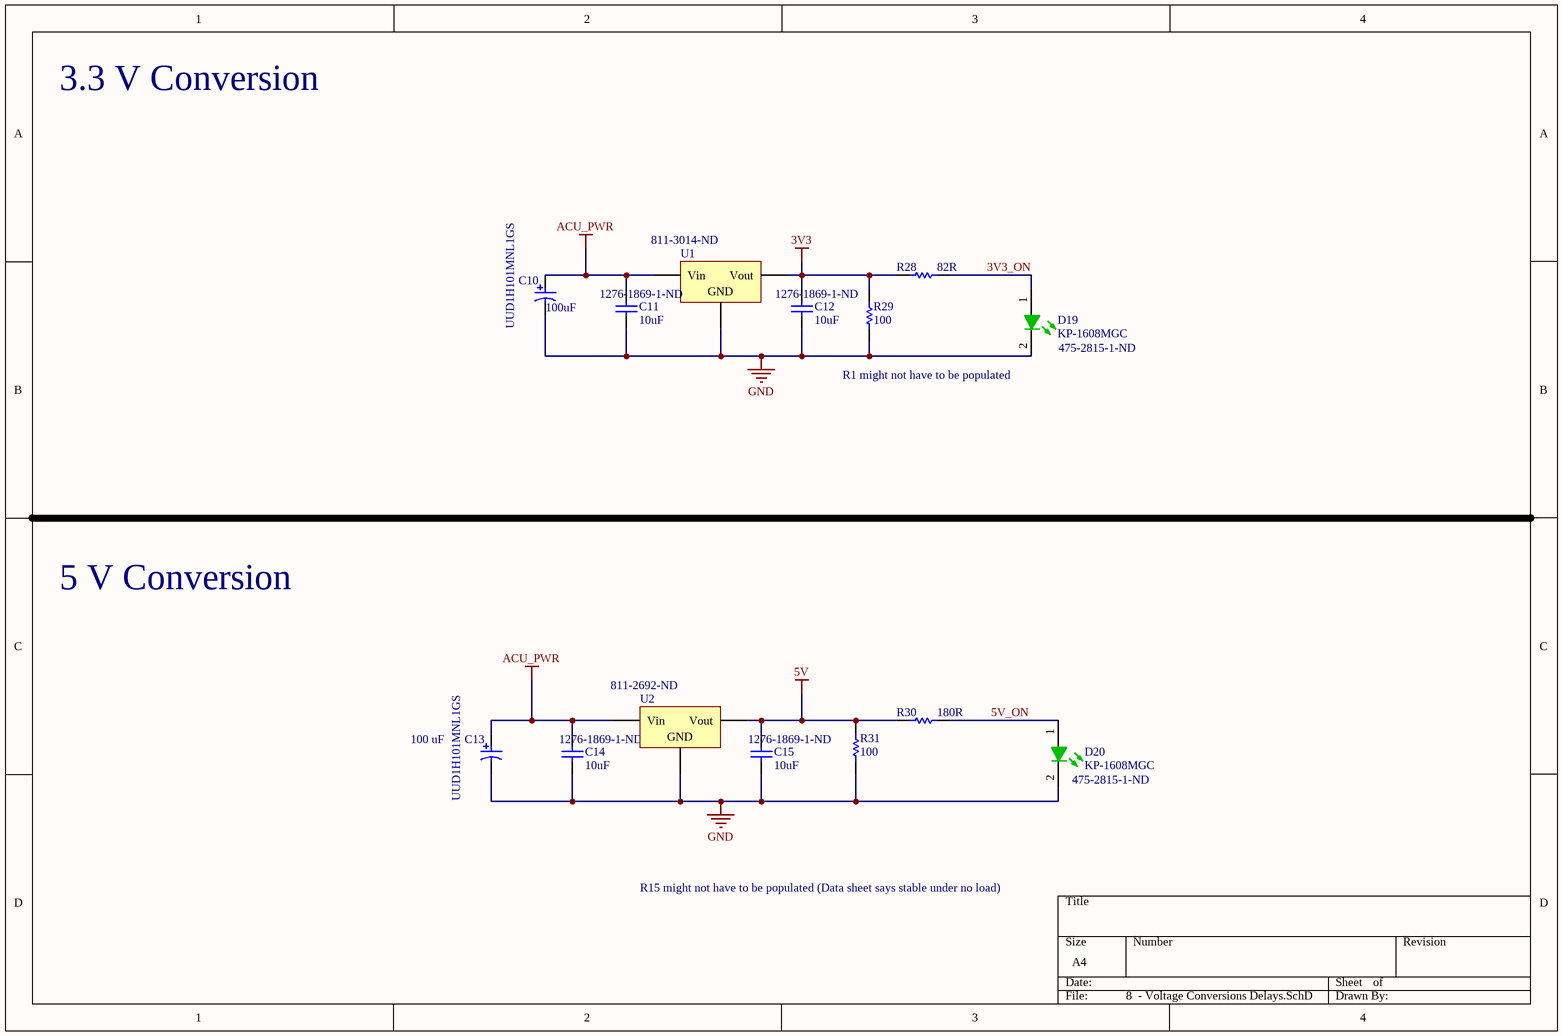
[diagram p5: 8  - Voltage Conversions Delays.SchDoc]

### Parts
(Parts that share a designator on the sheet are numbered #1, #2 ... from top to bottom, then left to right.)
C10  UUD1H101MNL1GS  [NIC-CAPA2-8X10_V]
C11  value 10uF  Supplier Part Number 2: 1276-1869-1-ND  [0603R-generic]  (hidden comment: Cap)
C12  value 10uF  Supplier Part Number 2: 1276-1869-1-ND  [0603R-generic]  (hidden comment: Cap)
C13  UUD1H101MNL1GS  Rated Capacitance: 100 uF  [NIC-CAPA2-8X10_V]
C14  value 10uF  Supplier Part Number 2: 1276-1869-1-ND  [0603R-generic]  (hidden comment: Cap)
C15  value 10uF  Supplier Part Number 2: 1276-1869-1-ND  [0603R-generic]  (hidden comment: Cap)
D19  KP-1608MGC  Supplier Part Number 1: 475-2815-1-ND  [KING-0603LED_GREEN_V]
D20  KP-1608MGC  Supplier Part Number 1: 475-2815-1-ND  [KING-0603LED_GREEN_V]
R28  value 82R  [1608[0603]]  (hidden comment: Res1)
R29  value 100  [1608[0603]]  (hidden comment: Res1)
R30  value 180R  [1608[0603]]  (hidden comment: Res1)
R31  value 100  [1608[0603]]  (hidden comment: Res1)
U1  Supplier Part Number 1: 811-3014-ND  [DCDC_VERTICAL]  (hidden comment: Volt Reg)
U2#2  Supplier Part Number 1: 811-2692-ND  [DCDC_HORIZONTAL]  (hidden comment: Volt Reg)

### Nets
3V3: C12.2 R28.1 R29.2 U1.3(Vout)
5V: C15.2 R30.1 R31.2 U2#2.3(Vout)
ACU_PWR: C10.1 C11.2 C13.1 C14.2 U1.1(Vin) U2#2.1(Vin)
GND: C10.2 C11.1 C12.1 C13.2 C14.1 C15.1 D19.2(K) D20.2(K) R29.1 R31.1 U1.2(GND) U2#2.2(GND)
3V3_ON: D19.1(A) R28.2
5V_ON: D20.1(A) R30.2

### Notes on the sheet
- 3.3 V Conversion
- (near C10) 100uF
- R1 might not have to be populated
- 5 V Conversion
- R15 might not have to be populated (Data sheet says stable under no load)

### Library data of the parts
C10 = CMP-0687-00073-1: Aluminum Electrolytic Capacitor, UD Series, Low Impedance, 100 uF, 50 V, + / - 20%, -55 to 105 degC, Chip Type, 8 x 10 mm D x L, Pb-Free, Reel; Manufacturer: Nichicon; Rated Ripple Current (at 100kHz): 300 mA; Tolerance Rated Capacitance: -20 to 20%; Packing: Dia382mm Reel; Impedance: 0.34 Ohm; Rated Voltage: 50 V; Endurance Time: 5000 h; Rated Capacitance: 100 uF; Capacitance: 100µF; Voltage Rating: 50V; Lifetime @ Temp.: 5000 Hrs @ 105°C; Polarization: Polar; Ripple Current: 300mA; Surface Mount Land Size: 0.327" L x 0.327" W (8.30mm x 8.30mm); ComponentLink3Description: Package Specification; ComponentLink2Description: Datasheet; PackageReference: CAPAE-D8H10; RoHS: TRUE; Length: 10 mm; Mounting Technology: Surface Mount; PackageDescription: 2-Pin Surface Mount Device, Diameter 8 mm, Height 10 mm, Pitch 6.5 mm; DatasheetVersion: 08/2012; Diameter: 8 mm; ComponentLink3URL: http://products.nichicon.co.jp/en/pdf/XJA043/e-ud.pdf; ComponentLink1Description: Manufacturer URL; PartNumber: UUD1H101MNL1GS; ComponentLink2URL: http://products.nichicon.co.jp/en/pdf/XJA043/e-ud.pdf; ComponentLink1URL: http://www.nichicon.co.jp/; Supplier 1: Digi-Key; Supplier Part Number 1: 493-2306-1-ND; Manufacturer Part Number: UUD1H101MNL1GS; Category: Capacitors; Stock 1: 65948; Pricing 1: 1=0.92, 10=0.685, 25=0.5868, 50=0.5478, 100=0.4696, 250=0.43044 (CAD); Packaging: Cut Tape (CT); Part Status: Active; Tolerance: ±20%; ESR (Equivalent Series Resistance): -; Operating Temperature: -55°C ~ 105°C; Applications: General Purpose; Lead Spacing: -; Size / Dimension: 0.315" Dia (8.00mm); Height - Seated (Max): 0.394" (10.00mm); Mounting Type: Surface Mount; Package / Case: Radial, Can - SMD; ComponentLink4URL: http://nichicon-us.com/english/products/pdfs/e-uud.pdf; ComponentLink4Description: http://nichicon-us.com/english/products/pdfs/e-uud.pdf
C11 C12 C14 C15 = Cap: as C4#1 on sheet 2  - Power Switch; Supplier 1: Digi-Key; Supplier Part Number 1: 311-2063-1-ND; RoHS: RoHS Compliant; Category: Capacitors; Stock 1: 1156; Pricing 1: 1=0.47, 10=0.323, 25=0.258, 50=0.2154, 100=0.1829, 250=0.14528, 500=0.12912, 1000=0.11298 (CAD); Packaging: Cut Tape (CT); Part Status: Active; Operating Temperature: -30°C ~ 85°C; Features: -; Ratings: -; Applications: General Purpose; Failure Rate: -; Mounting Type: Surface Mount, MLCC; Package / Case: 1210 (3225 Metric); Size / Dimension: 0.126" L x 0.098" W (3.20mm x 2.50mm); Height - Seated (Max): -; Thickness (Max): 0.083" (2.10mm); Lead Spacing: -; Lead Style: -; ComponentLink1URL: http://www.yageo.com/documents/recent/UPY-GPHC_Y5V_6.3V-to-50V_7.pdf; ComponentLink1Description: http://www.yageo.com/documents/recent/UPY-GPHC_Y5V_6.3V-to-50V_7.pdf; Supplier 2: Digi-Key
C13 = CMP-0687-00073-1: as C1 on sheet 3  - Fuses; ComponentLink3Description: Package Specification; ComponentLink2Description: Datasheet; PackageReference: CAPAE-D8H10; RoHS: TRUE; Length: 10 mm; Mounting Technology: Surface Mount; PackageDescription: 2-Pin Surface Mount Device, Diameter 8 mm, Height 10 mm, Pitch 6.5 mm; DatasheetVersion: 08/2012; Diameter: 8 mm; ComponentLink3URL: http://products.nichicon.co.jp/en/pdf/XJA043/e-ud.pdf; ComponentLink1Description: Manufacturer URL; PartNumber: UUD1H101MNL1GS; ComponentLink2URL: http://products.nichicon.co.jp/en/pdf/XJA043/e-ud.pdf; ComponentLink1URL: http://www.nichicon.co.jp/; Supplier 1: Digi-Key; Supplier Part Number 1: 493-2306-1-ND; Manufacturer Part Number: UUD1H101MNL1GS; Category: Capacitors; Stock 1: 65948; Pricing 1: 1=0.92, 10=0.685, 25=0.5868, 50=0.5478, 100=0.4696, 250=0.43044 (CAD); Packaging: Cut Tape (CT); Part Status: Active; Tolerance: ±20%; ESR (Equivalent Series Resistance): -; Operating Temperature: -55°C ~ 105°C; Applications: General Purpose; Lead Spacing: -; Size / Dimension: 0.315" Dia (8.00mm); Height - Seated (Max): 0.394" (10.00mm); Mounting Type: Surface Mount; Package / Case: Radial, Can - SMD; ComponentLink4URL: http://nichicon-us.com/english/products/pdfs/e-uud.pdf; ComponentLink4Description: http://nichicon-us.com/english/products/pdfs/e-uud.pdf
D19 D20 = CMP-0404-00001-1: as D1 on sheet 3  - Fuses; Mounting Technology: Surface Mount; Storage Temperature: -40 to +85 degC; ComponentLink1URL: http://www.kingbright.com/; PackageDescription: 2-Pin SMT LED, 1.6 x 0.8 mm Pitch; PartNumber: KP-1608MGC; PackageReference: 0603LED_GREEN; ComponentLink1Description: Manufacturer URL; Supplier 1: Digi-Key
R28 R29 R31 = Res1: Resistor; Manufacturer: Yageo; Manufacturer Part Number: RC0603JR-0782RL; Resistance (Ohms): 82; Tolerance: ±5%; Power (Watts): 0.1W, 1/10W; Temperature Coefficient: ±100ppm/°C; Supplier 1: Digi-Key; Supplier Part Number 1: 311-82GRCT-ND; RoHS: RoHS Compliant; Category: Resistors; Stock 1: 72049; Pricing 1: 1=0.16, 10=0.016, 25=0.0112, 50=0.0084, 100=0.0062, 250=0.0048, 500=0.00382, 1000=0.00281 (CAD); Packaging: Cut Tape (CT); Part Status: Active; Composition: Thick Film; Features: Moisture Resistant; Operating Temperature: -55°C ~ 155°C; Package / Case: 0603 (1608 Metric); Supplier Device Package: 0603; Size / Dimension: 0.063" L x 0.031" W (1.60mm x 0.80mm); Height - Seated (Max): 0.022" (0.55mm); Number of Terminations: 2; Failure Rate: -; ComponentLink1URL: http://www.yageo.com/NewPortal/yageodocoutput?fileName=/pdf/R-Chip/PYu-RC_Group_51_RoHS_L_4.pdf; ComponentLink1Description: http://www.yageo.com/NewPortal/yageodocoutput?fileName=/pdf/R-Chip/PYu-RC_Group_51_RoHS_L_4.pdf
R30 = Res1: Resistor; Manufacturer: Yageo; Manufacturer Part Number: RC0603JR-07180RL; Resistance (Ohms): 180; Tolerance: ±5%; Power (Watts): 0.1W, 1/10W; Temperature Coefficient: ±100ppm/°C; Supplier 1: Digi-Key; Supplier Part Number 1: 311-180GRCT-ND; RoHS: RoHS Compliant; Category: Resistors; Stock 1: 201936; Pricing 1: 1=0.16, 10=0.016, 25=0.0112, 50=0.0084, 100=0.0062, 250=0.0048, 500=0.00382, 1000=0.00281 (CAD); Packaging: Cut Tape (CT); Part Status: Active; Composition: Thick Film; Features: Moisture Resistant; Operating Temperature: -55°C ~ 155°C; Package / Case: 0603 (1608 Metric); Supplier Device Package: 0603; Size / Dimension: 0.063" L x 0.031" W (1.60mm x 0.80mm); Height - Seated (Max): 0.022" (0.55mm); Number of Terminations: 2; Failure Rate: -; ComponentLink1URL: http://www.yageo.com/NewPortal/yageodocoutput?fileName=/pdf/R-Chip/PYu-RC_Group_51_RoHS_L_4.pdf; ComponentLink1Description: http://www.yageo.com/NewPortal/yageodocoutput?fileName=/pdf/R-Chip/PYu-RC_Group_51_RoHS_L_4.pdf
U1 U2#2 = Volt Reg: Voltage Regulator; Published: 24-Mar-1999; LatestRevisionDate: 29-May-2009; LatestRevisionNote: IPC-7351 Footprint Added.; PackageReference: D2PAK; Publisher: Altium Limited; PackageDescription: 3-Pin Transistor Outline Package 2.54 mm Pitch, 15.1 mm Lead Span; Supplier 1: Digi-Key; Supplier 2: Digi-Key